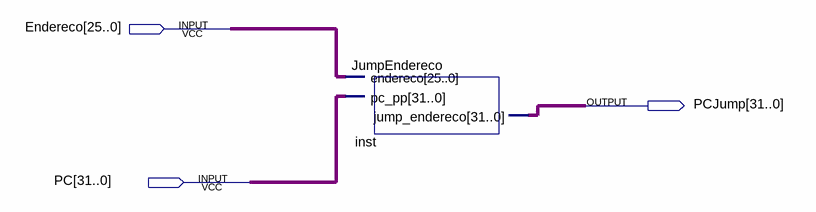
[diagram p0: schematic sheet]
// Quartus schematic JumpEndereco_test.bdf as structural Verilog: 1 symbols, 3 pins
module JumpEndereco_test (
  input  [25:0] Endereco,
  input  [31:0] PC,
  output [31:0] PCJump
);

  JumpEndereco inst (.endereco(Endereco), .pc_pp(PC), .jump_endereco(PCJump));
endmodule
